# Altium project Fuel Cell Monitor Master.PrjPcb (part 2 of 2)

## Sheet LT1990(Input2).SchDoc
size E; SheetNumber: 5; SheetTotal: 6
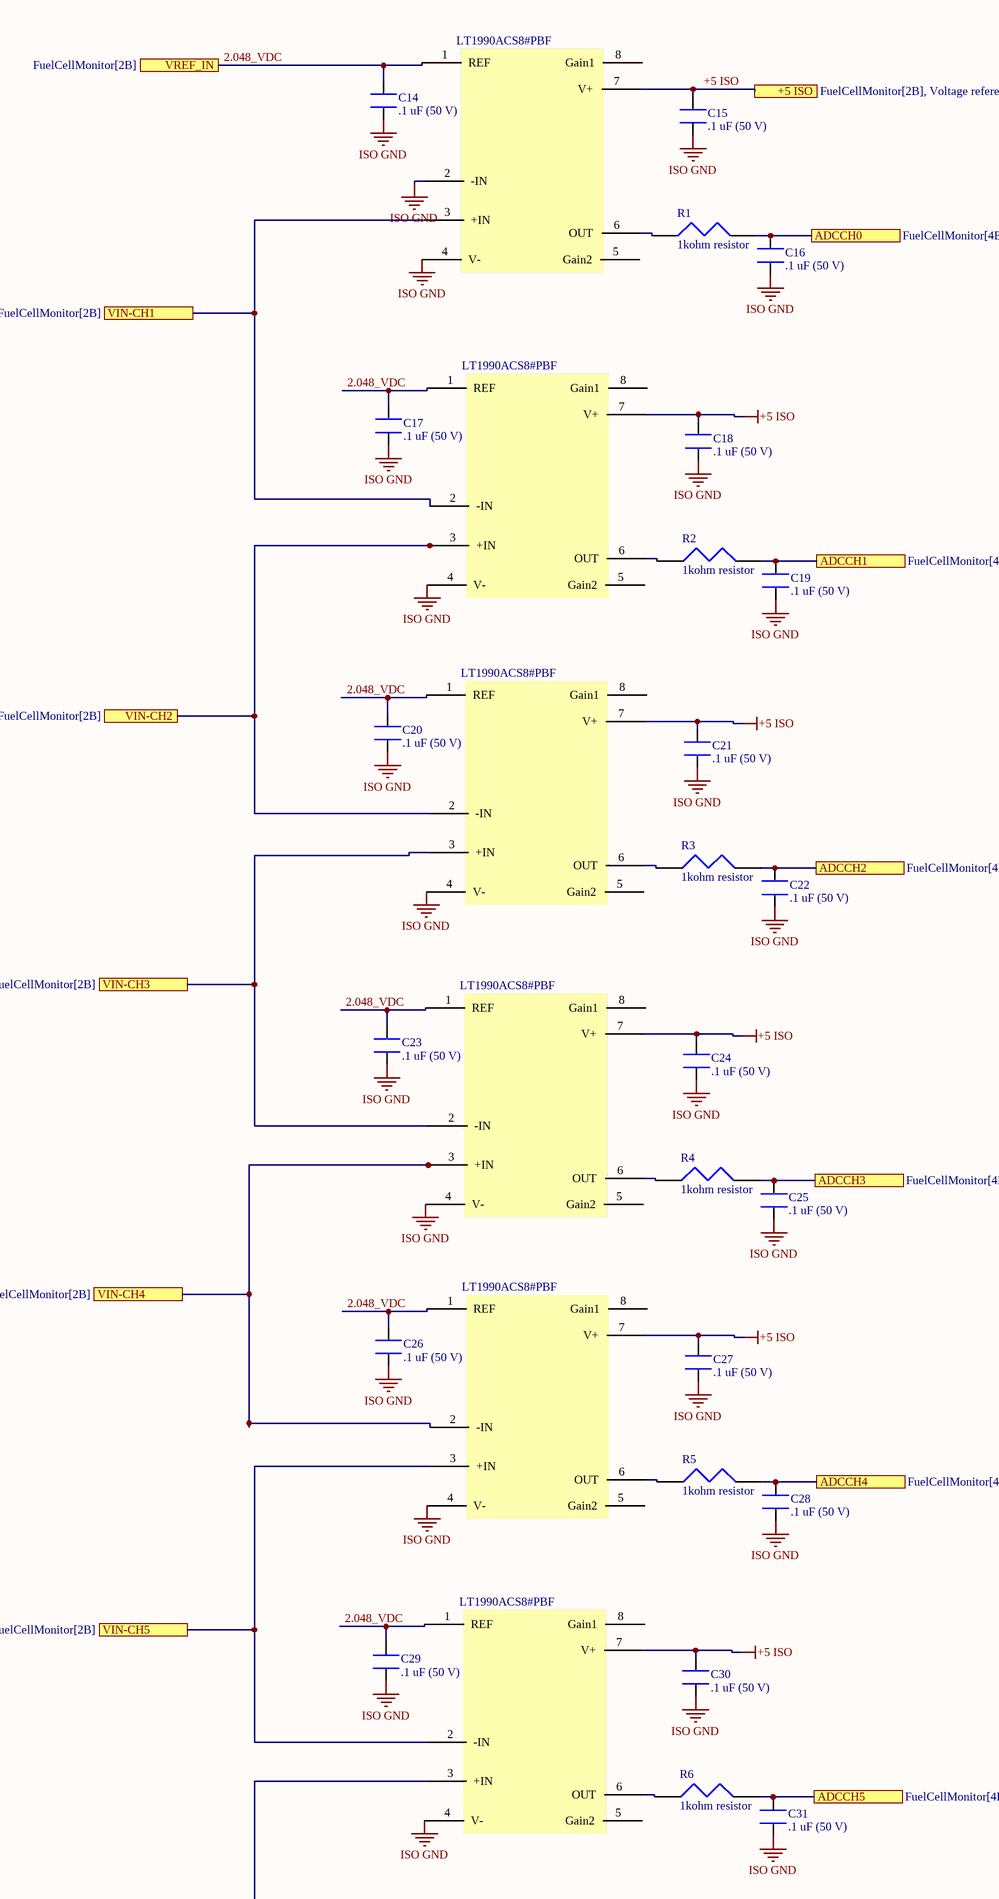
[diagram p6: LT1990(Input2).SchDoc, top left]
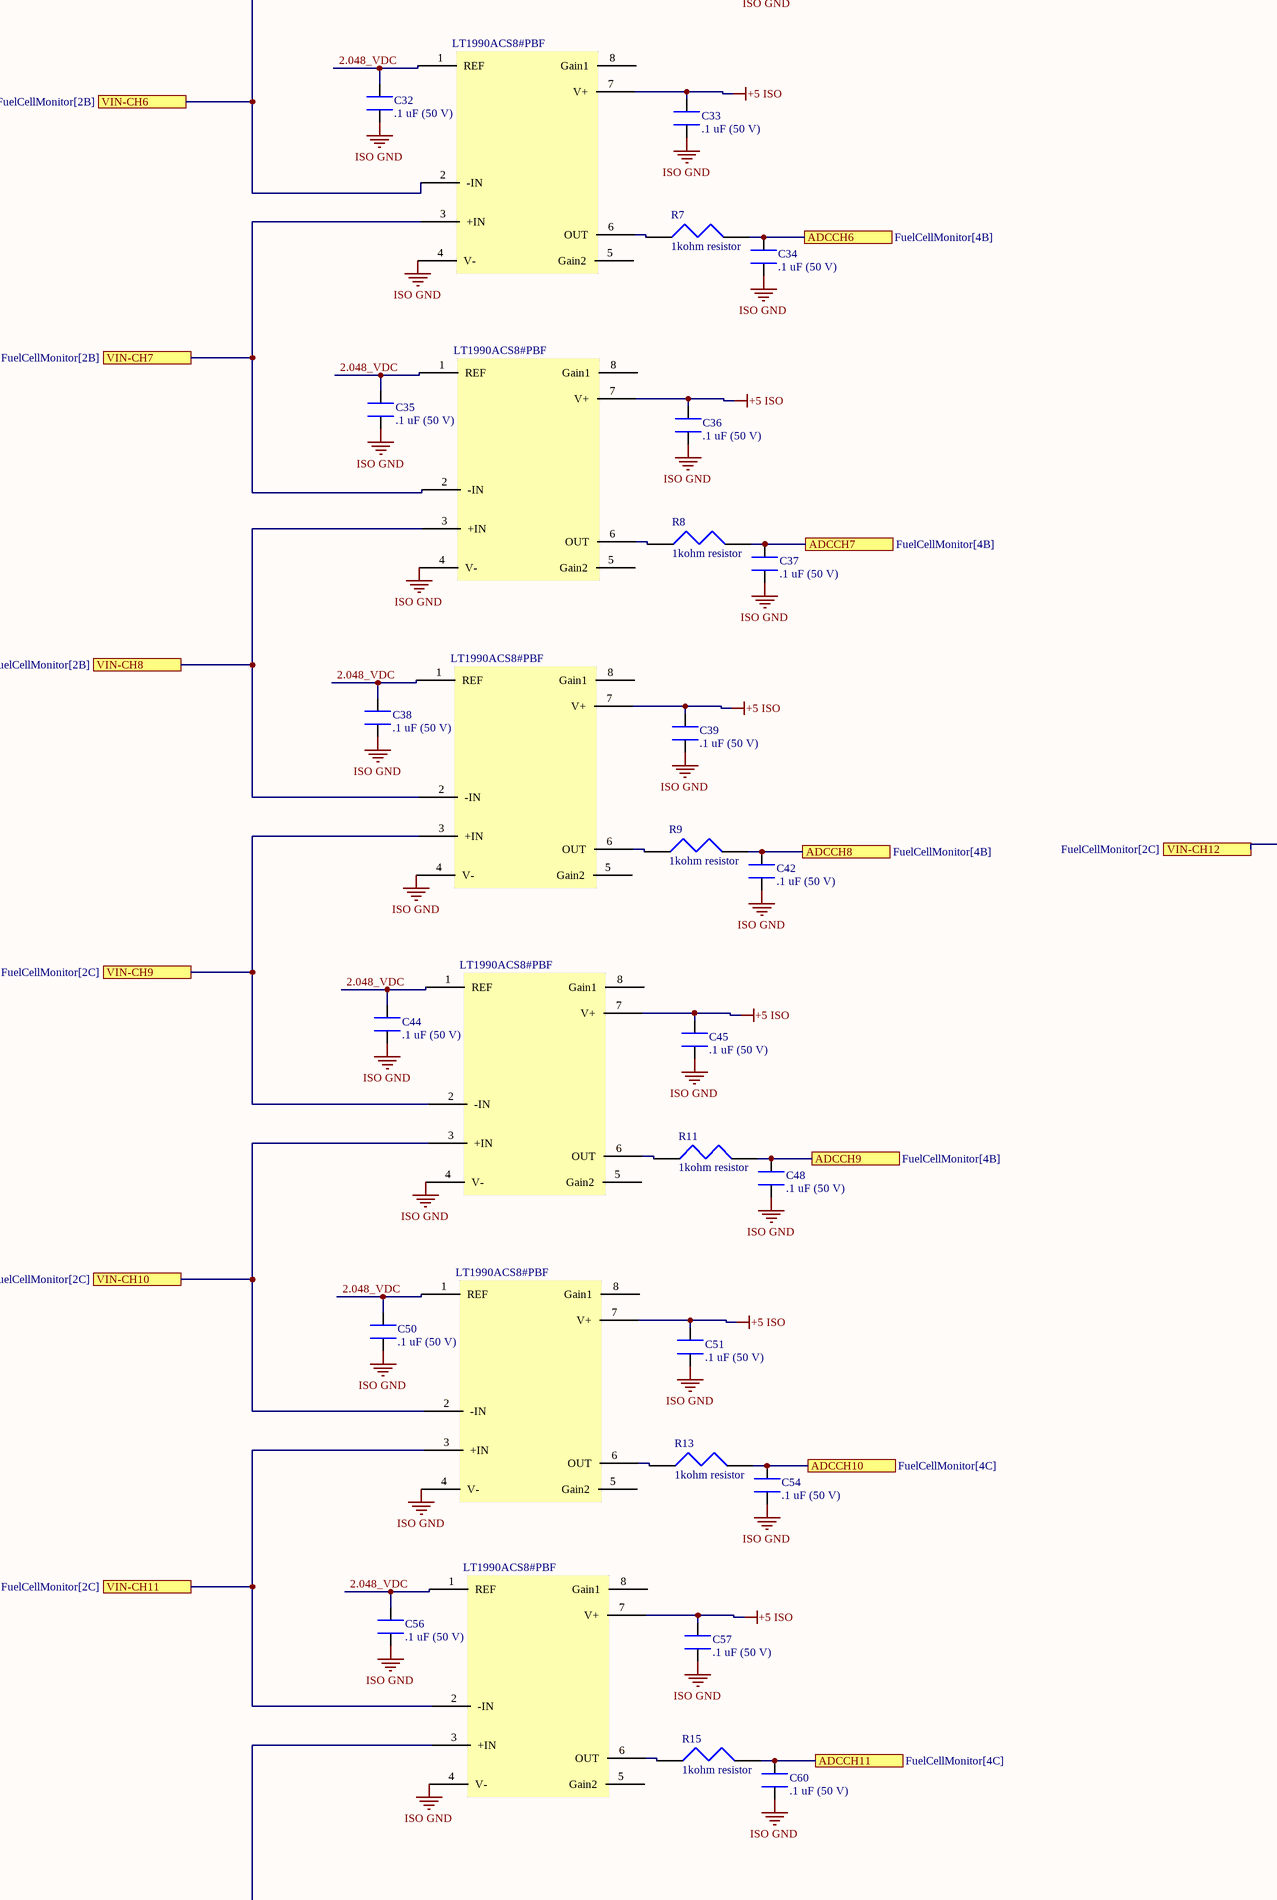
[diagram p7: LT1990(Input2).SchDoc, bottom left]
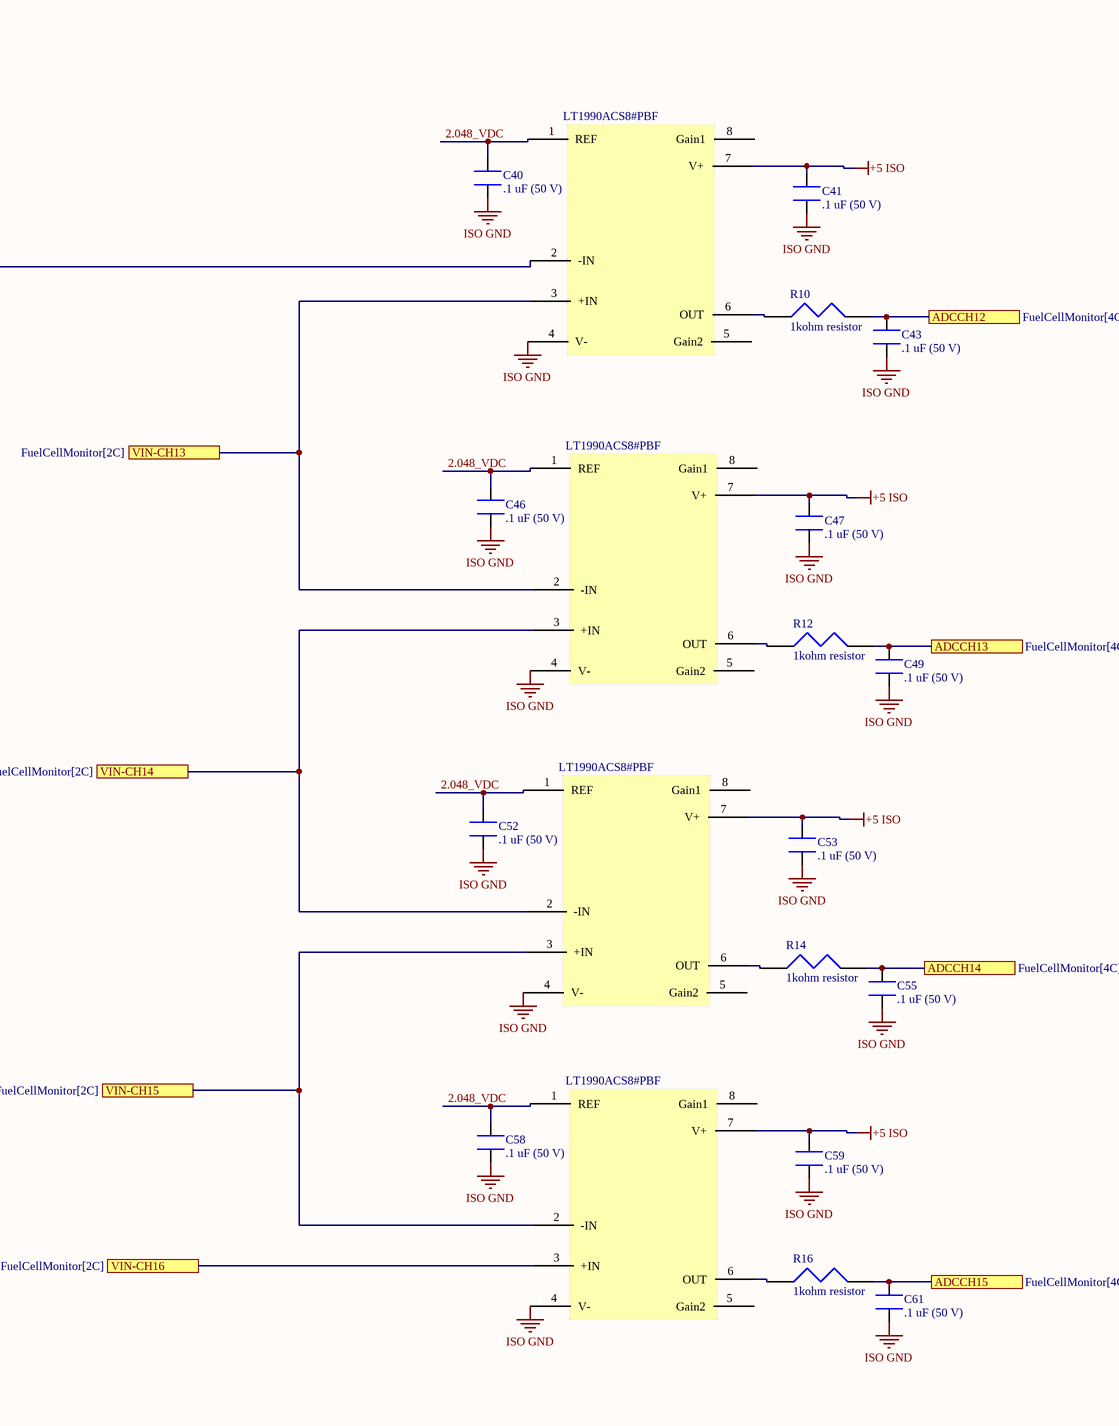
[diagram p8: LT1990(Input2).SchDoc, bottom right]

### Parts
(Parts that share a designator on the sheet are numbered #1, #2 ... from top to bottom, then left to right.)
C14#2  .1 uF (50 V)  [.1uF capacitor]
C15#2  .1 uF (50 V)  [.1uF capacitor]
C16#2  .1 uF (50 V)  [.1uF capacitor]
C17#2  .1 uF (50 V)  [.1uF capacitor]
C18#2  .1 uF (50 V)  [.1uF capacitor]
C19#2  .1 uF (50 V)  [.1uF capacitor]
C20#2  .1 uF (50 V)  [.1uF capacitor]
C21#2  .1 uF (50 V)  [.1uF capacitor]
C22  .1 uF (50 V)  [.1uF capacitor]
C23  .1 uF (50 V)  [.1uF capacitor]
C24  .1 uF (50 V)  [.1uF capacitor]
C25  .1 uF (50 V)  [.1uF capacitor]
C26  .1 uF (50 V)  [.1uF capacitor]
C27  .1 uF (50 V)  [.1uF capacitor]
C28  .1 uF (50 V)  [.1uF capacitor]
C29  .1 uF (50 V)  [.1uF capacitor]
C30  .1 uF (50 V)  [.1uF capacitor]
C31  .1 uF (50 V)  [.1uF capacitor]
C32  .1 uF (50 V)  [.1uF capacitor]
C33  .1 uF (50 V)  [.1uF capacitor]
C34  .1 uF (50 V)  [.1uF capacitor]
C35  .1 uF (50 V)  [.1uF capacitor]
C36  .1 uF (50 V)  [.1uF capacitor]
C37  .1 uF (50 V)  [.1uF capacitor]
C38  .1 uF (50 V)  [.1uF capacitor]
C39  .1 uF (50 V)  [.1uF capacitor]
C40  .1 uF (50 V)  [.1uF capacitor]
C41  .1 uF (50 V)  [.1uF capacitor]
C42  .1 uF (50 V)  [.1uF capacitor]
C43  .1 uF (50 V)  [.1uF capacitor]
C44  .1 uF (50 V)  [.1uF capacitor]
C45  .1 uF (50 V)  [.1uF capacitor]
C46  .1 uF (50 V)  [.1uF capacitor]
C47  .1 uF (50 V)  [.1uF capacitor]
C48  .1 uF (50 V)  [.1uF capacitor]
C49  .1 uF (50 V)  [.1uF capacitor]
C50  .1 uF (50 V)  [.1uF capacitor]
C51  .1 uF (50 V)  [.1uF capacitor]
C52  .1 uF (50 V)  [.1uF capacitor]
C53  .1 uF (50 V)  [.1uF capacitor]
C54  .1 uF (50 V)  [.1uF capacitor]
C55  .1 uF (50 V)  [.1uF capacitor]
C56  .1 uF (50 V)  [.1uF capacitor]
C57  .1 uF (50 V)  [.1uF capacitor]
C58  .1 uF (50 V)  [.1uF capacitor]
C59  .1 uF (50 V)  [.1uF capacitor]
C60  .1 uF (50 V)  [.1uF capacitor]
C61  .1 uF (50 V)  [.1uF capacitor]
LT1  LT1990  [LT1990ACS8]  (value not drawn)
LT2  LT1990  [LT1990ACS8]  (value not drawn)
LT3  LT1990  [LT1990ACS8]  (value not drawn)
LT4  LT1990  [LT1990ACS8]  (value not drawn)
LT5  LT1990  [LT1990ACS8]  (value not drawn)
LT6  LT1990  [LT1990ACS8]  (value not drawn)
LT7  LT1990  [LT1990ACS8]  (value not drawn)
LT8  LT1990  [LT1990ACS8]  (value not drawn)
LT9  LT1990  [LT1990ACS8]  (value not drawn)
LT10  LT1990  [LT1990ACS8]  (value not drawn)
LT11  LT1990  [LT1990ACS8]  (value not drawn)
LT12  LT1990  [LT1990ACS8]  (value not drawn)
LT13  LT1990  [LT1990ACS8]  (value not drawn)
LT14  LT1990  [LT1990ACS8]  (value not drawn)
LT15  LT1990  [LT1990ACS8]  (value not drawn)
LT16  LT1990  [LT1990ACS8]  (value not drawn)
R1#2  1kohm resistor  [1kohm resistor]
R2#2  1kohm resistor  [1kohm resistor]
R3#2  1kohm resistor  [1kohm resistor]
R4#2  1kohm resistor  [1kohm resistor]
R5#2  1kohm resistor  [1kohm resistor]
R6#2  1kohm resistor  [1kohm resistor]
R7#2  1kohm resistor  [1kohm resistor]
R8#2  1kohm resistor  [1kohm resistor]
R9#2  1kohm resistor  [1kohm resistor]
R10#2  1kohm resistor  [1kohm resistor]
R11#2  1kohm resistor  [1kohm resistor]
R12#2  1kohm resistor  [1kohm resistor]
R13#2  1kohm resistor  [1kohm resistor]
R14#2  1kohm resistor  [1kohm resistor]
R15#2  1kohm resistor  [1kohm resistor]
R16  1kohm resistor  [1kohm resistor]

### Ports
+5 ISO (see FuelCellMonitor[2B], Voltage reference[2B]), ADCCH0 (see FuelCellMonitor[4B]), ADCCH1 (see FuelCellMonitor[4B]), ADCCH2 (see FuelCellMonitor[4B]), ADCCH3 (see FuelCellMonitor[4B]), ADCCH4 (see FuelCellMonitor[4B]), ADCCH5 (see FuelCellMonitor[4B]), ADCCH6 (see FuelCellMonitor[4B]), ADCCH7 (see FuelCellMonitor[4B]), ADCCH8 (see FuelCellMonitor[4B]), ADCCH9 (see FuelCellMonitor[4B]), ADCCH10 (see FuelCellMonitor[4C]), ADCCH11 (see FuelCellMonitor[4C]), ADCCH12 (see FuelCellMonitor[4C]), ADCCH13 (see FuelCellMonitor[4C]), ADCCH14 (see FuelCellMonitor[4C]), ADCCH15 (see FuelCellMonitor[4C]), VIN-CH1 (see FuelCellMonitor[2B]), VIN-CH2 (see FuelCellMonitor[2B]), VIN-CH3 (see FuelCellMonitor[2B]), VIN-CH4 (see FuelCellMonitor[2B]), VIN-CH5 (see FuelCellMonitor[2B]), VIN-CH6 (see FuelCellMonitor[2B]), VIN-CH7 (see FuelCellMonitor[2B]), VIN-CH8 (see FuelCellMonitor[2B]), VIN-CH9 (see FuelCellMonitor[2C]), VIN-CH10 (see FuelCellMonitor[2C]), VIN-CH11 (see FuelCellMonitor[2C]), VIN-CH12 (see FuelCellMonitor[2C]), VIN-CH13 (see FuelCellMonitor[2C]), VIN-CH14 (see FuelCellMonitor[2C]), VIN-CH15 (see FuelCellMonitor[2C]), VIN-CH16 (see FuelCellMonitor[2C]), VREF_IN (see FuelCellMonitor[2B])

### Nets
+5 ISO: C15#2.2 C18#2.2 C21#2.2 C24.2 C27.2 C30.2 C33.2 C36.2 C39.2 C41.2 C45.2 C47.2 C51.2 C53.2 C57.2 C59.2 LT1.7(V+) LT2.7(V+) LT3.7(V+) LT4.7(V+) LT5.7(V+) LT6.7(V+) LT7.7(V+) LT8.7(V+) LT9.7(V+) LT10.7(V+) LT11.7(V+) LT12.7(V+) LT13.7(V+) LT14.7(V+) LT15.7(V+) LT16.7(V+) ; port +5 ISO
ISO GND: C14#2.1 C15#2.1 C16#2.1 C17#2.1 C18#2.1 C19#2.1 C20#2.1 C21#2.1 C22.1 C23.1 C24.1 C25.1 C26.1 C27.1 C28.1 C29.1 C30.1 C31.1 C32.1 C33.1 C34.1 C35.1 C36.1 C37.1 C38.1 C39.1 C40.1 C41.1 C42.1 C43.1 C44.1 C45.1 C46.1 C47.1 C48.1 C49.1 C50.1 C51.1 C52.1 C53.1 C54.1 C55.1 C56.1 C57.1 C58.1 C59.1 C60.1 C61.1 LT1.2(-IN) LT1.4(V-) LT2.4(V-) LT3.4(V-) LT4.4(V-) LT5.4(V-) LT6.4(V-) LT7.4(V-) LT8.4(V-) LT9.4(V-) LT10.4(V-) LT11.4(V-) LT12.4(V-) LT13.4(V-) LT14.4(V-) LT15.4(V-) LT16.4(V-)
2.048_VDC: C14#2.2 C17#2.2 C20#2.2 C23.2 C26.2 C29.2 C32.2 C35.2 C38.2 C40.2 C44.2 C46.2 C50.2 C52.2 C56.2 C58.2 LT1.1(REF) LT2.1(REF) LT3.1(REF) LT4.1(REF) LT5.1(REF) LT6.1(REF) LT7.1(REF) LT8.1(REF) LT9.1(REF) LT10.1(REF) LT11.1(REF) LT12.1(REF) LT13.1(REF) LT14.1(REF) LT15.1(REF) LT16.1(REF) ; port VREF_IN
Cell_1_Voltage: C16#2.2 R1#2.2 ; port ADCCH0
Cell_2_Voltage: C19#2.2 R2#2.2 ; port ADCCH1
Cell_3_Voltage: C22.2 R3#2.2 ; port ADCCH2
Cell_4_Voltage: C25.2 R4#2.2 ; port ADCCH3
Cell_5_Voltage: C28.2 R5#2.2 ; port ADCCH4
Cell_6_Voltage: C31.2 R6#2.2 ; port ADCCH5
Cell_7_Voltage: C34.2 R7#2.2 ; port ADCCH6
Cell_8_Voltage: C37.2 R8#2.2 ; port ADCCH7
Cell_9_Voltage: C42.2 R9#2.2 ; port ADCCH8
Cell_10_Voltage: C48.2 R11#2.2 ; port ADCCH9
Cell_11_Voltage: C54.2 R13#2.2 ; port ADCCH10
Cell_12_Voltage: C60.2 R15#2.2 ; port ADCCH11
Cell_13_Voltage: C43.2 R10#2.2 ; port ADCCH12
Cell_14_Voltage: C49.2 R12#2.2 ; port ADCCH13
Cell_15_Voltage: C55.2 R14#2.2 ; port ADCCH14
Cell_16_Voltage: C61.2 R16.2 ; port ADCCH15
Net1_1: LT1.3(+IN) LT2.2(-IN) ; port VIN-CH1
Net1_2: LT2.3(+IN) LT3.2(-IN) ; port VIN-CH2
Net1_3: LT3.3(+IN) LT4.2(-IN) ; port VIN-CH3
Net1_4: LT4.3(+IN) LT5.2(-IN) ; port VIN-CH4
Net1_5: LT5.3(+IN) LT6.2(-IN) ; port VIN-CH5
Net1_6: LT6.3(+IN) LT7.2(-IN) ; port VIN-CH6
Net1_7: LT7.3(+IN) LT8.2(-IN) ; port VIN-CH7
Net1_8: LT8.3(+IN) LT9.2(-IN) ; port VIN-CH8
Net1_9: LT9.3(+IN) LT10.2(-IN) ; port VIN-CH9
Net1_10: LT10.3(+IN) LT11.2(-IN) ; port VIN-CH10
Net1_11: LT11.3(+IN) LT12.2(-IN) ; port VIN-CH11
Net1_12: LT12.3(+IN) LT13.2(-IN) ; port VIN-CH12
Net1_13: LT13.3(+IN) LT14.2(-IN) ; port VIN-CH13
Net1_14: LT14.3(+IN) LT15.2(-IN) ; port VIN-CH14
Net1_15: LT15.3(+IN) LT16.2(-IN) ; port VIN-CH15
Net1_16: LT16.3(+IN) ; port VIN-CH16
NetLT1_6: LT1.6(OUT) R1#2.1
NetLT2_6: LT2.6(OUT) R2#2.1
NetLT3_6: LT3.6(OUT) R3#2.1
NetLT4_6: LT4.6(OUT) R4#2.1
NetLT5_6: LT5.6(OUT) R5#2.1
NetLT6_6: LT6.6(OUT) R6#2.1
NetLT7_6: LT7.6(OUT) R7#2.1
NetLT8_6: LT8.6(OUT) R8#2.1
NetLT9_6: LT9.6(OUT) R9#2.1
NetLT10_6: LT10.6(OUT) R11#2.1
NetLT11_6: LT11.6(OUT) R13#2.1
NetLT12_6: LT12.6(OUT) R15#2.1
NetLT13_6: LT13.6(OUT) R10#2.1
NetLT14_6: LT14.6(OUT) R12#2.1
NetLT15_6: LT15.6(OUT) R14#2.1
NetLT16_6: LT16.6(OUT) R16.1

Not connected (* = marked no-connect by the designer): LT1 5(Gain2) 8(Gain1); LT2 5(Gain2) 8(Gain1); LT3 5(Gain2) 8(Gain1); LT4 5(Gain2) 8(Gain1); LT5 5(Gain2) 8(Gain1); LT6 5(Gain2) 8(Gain1); LT7 5(Gain2) 8(Gain1); LT8 5(Gain2) 8(Gain1); LT9 5(Gain2) 8(Gain1); LT10 5(Gain2) 8(Gain1); LT11 5(Gain2) 8(Gain1); LT12 5(Gain2) 8(Gain1); LT13 5(Gain2) 8(Gain1); LT14 5(Gain2) 8(Gain1); LT15 5(Gain2) 8(Gain1); LT16 5(Gain2) 8(Gain1)

### Notes on the sheet
- (in symbol LT1990) LT1990ACS8#PBF

### Library data of the parts
C14#2 C15#2 C16#2 C17#2 C18#2 C19#2 C20#2 C21#2 C22-C61 = .1 uF cap

## Sheet Voltage reference.SchDoc
size A; SheetNumber: 6; SheetTotal: 6
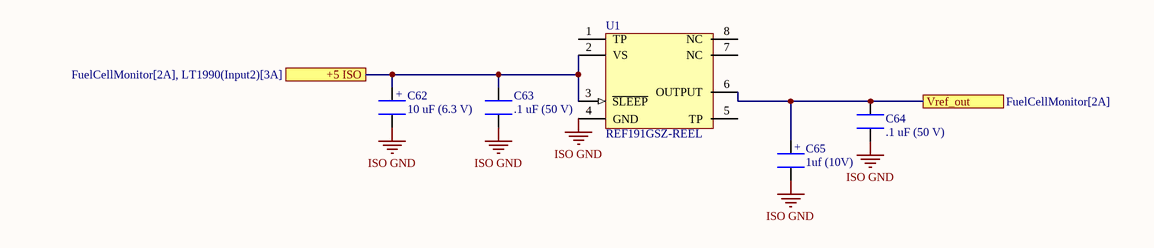
[diagram p9: Voltage reference.SchDoc]

### Parts
C62  10 uF (6.3 V)  [10 uF cap]
C63  .1 uF (50 V)  [.1uF capacitor]
C64  .1 uF (50 V)  [.1uF capacitor]
C65  1uf (10V)  [1 uF cap]
U1  REF191GSZ-REEL  [ADI-R-8_N]

### Ports
+5 ISO (see FuelCellMonitor[2A], LT1990(Input2)[3A]), Vref_out (see FuelCellMonitor[2A])

### Nets
ISO GND: C62.2 C63.2 C64.1 C65.2 U1.4(GND)
2.048_VDC: C64.2 C65.1 U1.6(OUTPUT) ; port Vref_out
NetC62_1: C62.1 C63.1 U1.2(VS) U1.3(~{SLEEP}) ; port +5 ISO

Not connected (* = marked no-connect by the designer): U1 1(TP) 5(TP) 7(NC) 8(NC)

### Notes on the sheet
- (in symbol 1uf cap) +
- (in symbol 10 uF cap) +

### Library data of the parts
C62 = 10 uF cap
C63 C64 = .1 uF cap
C65 = 1uf cap
U1 = REF191GSZ-REEL: Precision Micropower, Low Dropout Voltage Reference, 2.048 V Output, 2.3 to 15 V Supply, Industrial, 8-pin SOIC (R-8), Reel; Manufacturer: Analog Devices; Vout: 2.048V; Ref Out TC (ppm/C): 10; Mounting Technology: Surface Mount; ComponentLink3URL: http://www.analog.com/static/imported-files/packages/PKG_PDF/SOIC_Narrow%20(R)/R_8.pdf; PackageDescription: 8-Pin Standard Small Outline Package, Body 4.9 x 3.9 mm, Pitch 1.27 mm; PackageVersion: 060506-A, 06/2006; ComponentLink1Description: Manufacturer URL; Code_JEDEC: MS-012-AA; ComponentLink2URL: http://www.analog.com/static/imported-files/data_sheets/REF19xSeries.pdf; Operating Temp Range: -40 to 85 degC; PartNumber: REF191GSZ-REEL; Packing: Reel; ComponentLink3Description: Package Specification; ComponentLink4Description: URL Link1; PackageReference: R-8; ComponentLink1URL: http://www.analog.com/en/index.html; ComponentLink4URL: Product URL:http://www.analog.com/en/special-linear-functions/voltage-references/ref191/products/product.html; DatasheetVersion: Rev. L; ComponentLink2Description: Datasheet

## Sheet LM2595sx-3.3.SchDoc
size A; SheetNumber: 3; SheetTotal: 6
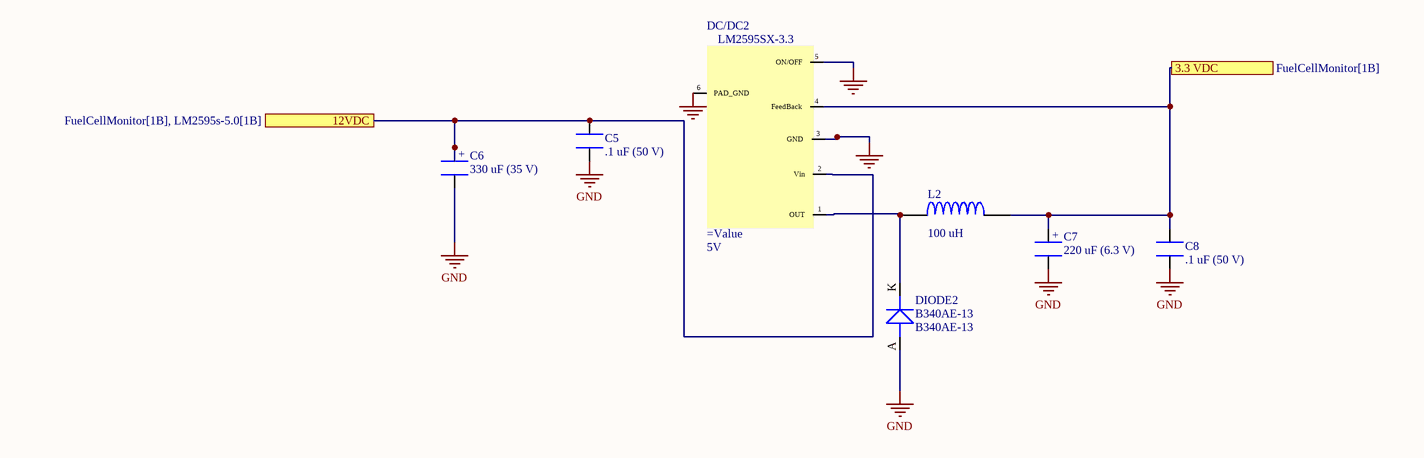
[diagram p10: LM2595sx-3.3.SchDoc]

### Parts
(Parts that share a designator on the sheet are numbered #1, #2 ... from top to bottom, then left to right.)
C5#2  .1 uF (50 V)  [.1uF capacitor]
C6#2  330 uF (35 V)  [330uf cap]
C7#2  220 uF (6.3 V)  [220 uf cap]
C8#2  .1 uF (50 V)  [.1uF capacitor]
DC/DC2  Output Voltage: 5V  [LM2595s-3.3]
DIODE2  B340AE-13  [B340AE-13]
L2  100 uH  [100uH inductor]

### Ports
3.3 VDC (see FuelCellMonitor[1B]), 12VDC (see FuelCellMonitor[1B], LM2595s-5.0[1B])

### Nets
+3V3: C7#2.1 C8#2.2 DC/DC2.4(FeedBack) L2.2 ; port 3.3 VDC
+12: C5#2.2 C6#2.1 DC/DC2.2(Vin) ; port 12VDC
GND: C5#2.1 C6#2.2 C7#2.2 C8#2.1 DC/DC2.3(GND) DC/DC2.5(ON/OFF) DC/DC2.6(PAD_GND) DIODE2.A
NetDC/DC2_1: DC/DC2.1(OUT) DIODE2.K L2.1

### Notes on the sheet
- (in symbol 220 uF capacitor) +
- (in symbol 330 uF cap) +
- (in symbol LM2595SX-3.3/NOPB_1) LM2595SX-3.3

### Library data of the parts
C5#2 C8#2 = .1 uF cap
C6#2 = 330 uF cap
C7#2 = 220 uF capacitor
DC/DC2 = LM2595SX-3.3/NOPB_1: SIMPLE SWITCHE Power Converter 150 KHz 1A Step-Down Voltage egulator 5-DDPAK/TO-263; Manufacturer: Texas Instruments; Manufacturer Part Number: LM2595S-5.0/NOPB; Number of Outputs: 1; Efficiency: 82%; Min Input Voltage: 4.5V; Max Input Voltage: 40V; Frequency: 150kHz; Switching Frequency: 173kHz; Quiescent Current: 5mA; Output Type: Fixed; Supplier 1: Digi-Key; RoHS: Yes; Category: Voltage Regulators - Switching; Mount: Surface Mount; Case/Package: TO-263; Number of Pins: 5; Weight: 0.25lb; Min Operating Temperature: -40°C; Max Operating Temperature: 125°C; Output Current: 1A; Package Quantity: 45; Packaging: Rail/Tube; Max Output Current: 1A; Max Supply Voltage: 40V; Min Supply Voltage: 4.5V; Nominal Output Voltage: 5V; Max Output Voltage: 5V; Termination: SMD/SMT; Length: 10.16mm; Width: 8.64mm; Height: 4.57mm; Radiation Hardening: No; Lead Free: Contains Lead; RoHS Compliant: Yes; REACH SVHC: No SVHC; ComponentLink1URL: https://datasheet.ciiva.com/14150/eanatsemico-schaltr-lm2595-en-14150687.pdf?src-supplier=Distrelec; ComponentLink1Description: https://datasheet.ciiva.com/14150/eanatsemico-schaltr-lm2595-en-14150687.pdf?src-supplier=Distrelec; ComponentLink2URL: https://datasheet.ciiva.com/15112/getdatasheetpartid-89913-15112836.pdf?src-supplier=Verical; ComponentLink2Description: https://datasheet.ciiva.com/15112/getdatasheetpartid-89913-15112836.pdf?src-supplier=Verical; ComponentLink3URL: https://datasheet.ciiva.com/25775/1771567-25775403.pdf?src-supplier=Farnell; ComponentLink3Description: https://datasheet.ciiva.com/25775/1771567-25775403.pdf?src-supplier=Farnell; ComponentLink4URL: https://datasheet.ciiva.com/22746/1771567-22746709.pdf?src-supplier=Element14; ComponentLink4Description: https://datasheet.ciiva.com/22746/1771567-22746709.pdf?src-supplier=Element14; ComponentLink5URL: https://datasheet.ciiva.com/3219/lm2595-3219977.pdf?src-supplier=Avnet; ComponentLink5Description: https://datasheet.ciiva.com/3219/lm2595-3219977.pdf?src-supplier=Avnet
DIODE2 = B340AE-13: Schottky Diode, DO-201, 40V, 3.00A; Manufacturer: STMicroelectronics; Max Surge Current: 80A; Average Rectified Current: 3A; Max Reverse Leakage Current: 2mA; Element Configuration: Single; Polarity: Standard; Forward Voltage: 950mV; Capacitance: 190pF; Supplier 1: Mouser; RoHS: Yes; Category: Rectifier Diodes; Stock 1: 125419; Pricing 1: 1=0.47000, 10=0.38600, 50=0.38600, 100=0.26300, 600=0.19700, 1000=0.19700, 1200=0.14700, 2400=0.12700, 9600=0.11900, 10000=0.11900 (USD); Mount: Through Hole; Case/Package: DO-201AD; Number of Pins: 2; Weight: 0.01lb; Min Operating Temperature: -65°C; Max Operating Temperature: 150°C; Package Quantity: 1; Packaging: Tape and Reel; Max Forward Surge Current (Ifsm): 80A; Voltage Rating (DC): 40V; Current Rating: 3A; Output Current: 3A; Max Reverse Voltage (DC): 40V; Series: -; Forward Current: 3A; Max Reverse Current: 2mA; Max Repetitive Reverse Voltage (Vrrm): 40V; Peak Non-Repetitive Surge Current: 80A; Length: 9.5mm; Width: 5.3mm; Height: 5.3mm; Radiation Hardening: No; Lead Free: Lead Free; RoHS Compliant: Yes; REACH SVHC: No SVHC; ComponentLink1URL: https://datasheet.ciiva.com/1177/1689683-1177129.pdf?src-supplier=Element14; ComponentLink1Description: https://datasheet.ciiva.com/1177/1689683-1177129.pdf?src-supplier=Element14; ComponentLink2URL: https://datasheet.ciiva.com/26339/168275-da-01-en-schottky-barrier-rectif-axial-1n5822-26339005.pdf?src-supplier=Conrad; ComponentLink2Description: https://datasheet.ciiva.com/26339/168275-da-01-en-schottky-barrier-rectif-axial-1n5822-26339005.pdf?src-supplier=Conrad; ComponentLink3URL: https://datasheet.ciiva.com/16303/cd00001626-16303311.pdf?src-supplier=Future+Electronics; ComponentLink3Description: https://datasheet.ciiva.com/16303/cd00001626-16303311.pdf?src-supplier=Future+Electronics; ComponentLink4URL: https://datasheet.ciiva.com/916/cd00001626-916051.pdf?src-supplier=Digi-Key; ComponentLink4Description: https://datasheet.ciiva.com/916/cd00001626-916051.pdf?src-supplier=Digi-Key; ComponentLink5URL: https://datasheet.ciiva.com/916/cd00001626-916050.pdf?src-supplier=Digi-Key; ComponentLink5Description: https://datasheet.ciiva.com/916/cd00001626-916050.pdf?src-supplier=Digi-Key; Supplier Part Number 1: 511-1N5822; Manufacturer Part Number: B340AE-13
L2 = 100 uH inductor

## Sheet DCP020505U.SchDoc
size A; SheetNumber: 4; SheetTotal: 6
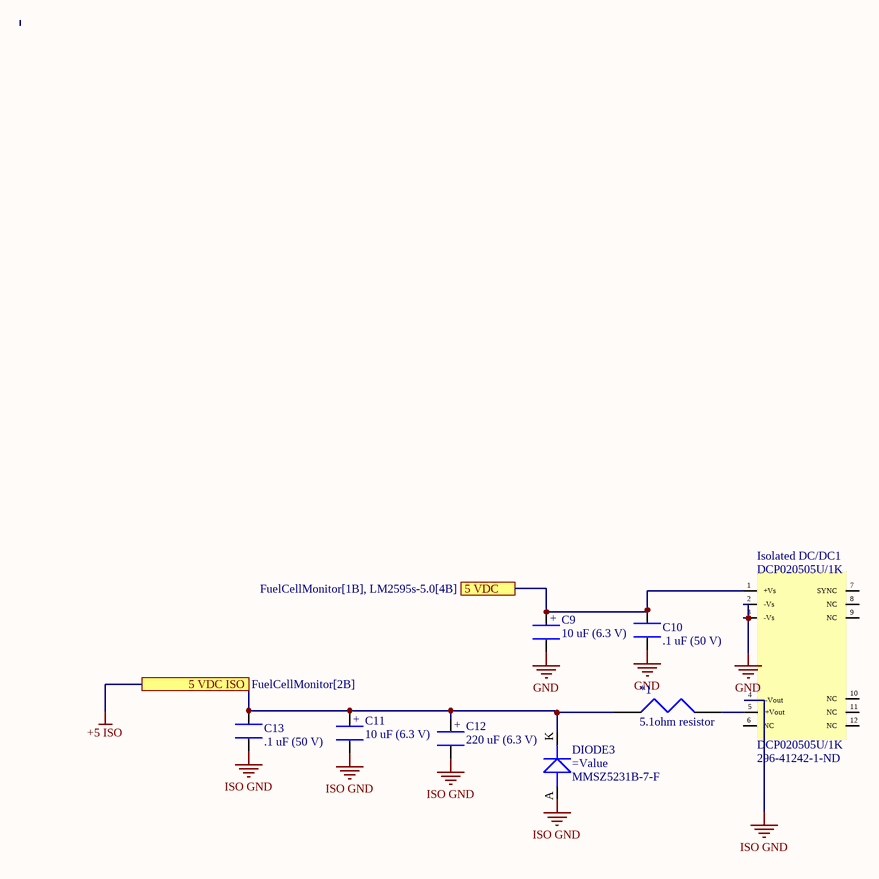
[diagram p11: DCP020505U.SchDoc]

### Parts
(Parts that share a designator on the sheet are numbered #1, #2 ... from top to bottom, then left to right.)
*1  5.1ohm resistor  [5.1 ohm resistor]
C9#2  10 uF (6.3 V)  [10 uF cap]
C10  .1 uF (50 V)  [.1uF capacitor]
C11  10 uF (6.3 V)  [10 uF cap]
C12  220 uF (6.3 V)  [220 uf cap]
C13  .1 uF (50 V)  [.1uF capacitor]
DIODE3  (no value)  [MMSZ5231B-7-F Zener diode]
Isolated_DC/DC1  DCP020505U/1K  Supplier Part Number 1: 296-41242-1-ND  [DCP020505U - duplicate]

### Ports
5 VDC (see FuelCellMonitor[1B], LM2595s-5.0[4B]), 5 VDC ISO (see FuelCellMonitor[2B])

### Nets
+5 ISO: *1.1 C11.1 C12.1 C13.2 DIODE3.K ; port 5 VDC ISO
GND: C9#2.2 C10.1 Isolated_DC/DC1.2(-Vs) Isolated_DC/DC1.3(-Vs)
ISO GND: C11.2 C12.2 C13.1 DIODE3.A Isolated_DC/DC1.4(-Vout)
Net*1_2: *1.2 Isolated_DC/DC1.5(+Vout)
NetC9#2_1: C9#2.1 C10.2 Isolated_DC/DC1.1(+Vs) ; port 5 VDC

Not connected (* = marked no-connect by the designer): Isolated_DC/DC1 6(NC) 7(SYNC) 8(NC) 9(NC) 10(NC) 11(NC) 12(NC)

### Notes on the sheet
- (in symbol 10 uF cap) +
- (in symbol 220 uF capacitor) +

### Library data of the parts
C9#2 C11 = 10 uF cap
C10 C13 = .1 uF cap
C12 = 220 uF capacitor
DIODE3 = MMSZ5231B-7-F: Zener diode; Manufacturer: STMicroelectronics; Max Surge Current: 80A; Average Rectified Current: 3A; Max Reverse Leakage Current: 2mA; Element Configuration: Single; Polarity: Standard; Voltage Rating (DC): 40V; Forward Voltage: 950mV; Capacitance: 190pF; Supplier 1: Mouser; RoHS: Yes; Category: Rectifier Diodes; Stock 1: 125419; Pricing 1: 1=0.47000, 10=0.38600, 50=0.38600, 100=0.26300, 600=0.19700, 1000=0.19700, 1200=0.14700, 2400=0.12700, 9600=0.11900, 10000=0.11900 (USD); Mount: Through Hole; Case/Package: DO-201AD; Number of Pins: 2; Weight: 0.01lb; Min Operating Temperature: -65°C; Max Operating Temperature: 150°C; Package Quantity: 1; Packaging: Tape and Reel; Max Forward Surge Current (Ifsm): 80A; Current Rating: 3A; Output Current: 3A; Max Reverse Voltage (DC): 40V; Series: -; Forward Current: 3A; Max Reverse Current: 2mA; Max Repetitive Reverse Voltage (Vrrm): 40V; Peak Non-Repetitive Surge Current: 80A; Length: 9.5mm; Width: 5.3mm; Height: 5.3mm; Radiation Hardening: No; Lead Free: Lead Free; RoHS Compliant: Yes; REACH SVHC: No SVHC; ComponentLink1URL: https://datasheet.ciiva.com/1177/1689683-1177129.pdf?src-supplier=Element14; ComponentLink1Description: https://datasheet.ciiva.com/1177/1689683-1177129.pdf?src-supplier=Element14; ComponentLink2URL: https://datasheet.ciiva.com/26339/168275-da-01-en-schottky-barrier-rectif-axial-1n5822-26339005.pdf?src-supplier=Conrad; ComponentLink2Description: https://datasheet.ciiva.com/26339/168275-da-01-en-schottky-barrier-rectif-axial-1n5822-26339005.pdf?src-supplier=Conrad; ComponentLink3URL: https://datasheet.ciiva.com/16303/cd00001626-16303311.pdf?src-supplier=Future+Electronics; ComponentLink3Description: https://datasheet.ciiva.com/16303/cd00001626-16303311.pdf?src-supplier=Future+Electronics; ComponentLink4URL: https://datasheet.ciiva.com/916/cd00001626-916051.pdf?src-supplier=Digi-Key; ComponentLink4Description: https://datasheet.ciiva.com/916/cd00001626-916051.pdf?src-supplier=Digi-Key; ComponentLink5URL: https://datasheet.ciiva.com/916/cd00001626-916050.pdf?src-supplier=Digi-Key; ComponentLink5Description: https://datasheet.ciiva.com/916/cd00001626-916050.pdf?src-supplier=Digi-Key; Supplier Part Number 1: 511-1N5822; Manufacturer Part Number: MMSZ5231B-7-F
Isolated_DC/DC1 = DCP020505U/1K: Miniature, 2W Isolated Unregulated DC/DC Converters 12-SOP -40 to 85; Manufacturer: Texas Instruments; Number of Outputs: 1; Efficiency: 80%; Max Output Current: 400mA; Max Input Voltage: 5.5V; Min Input Voltage: 4.5V; Voltage - Output 1: 5V; Isolation Voltage: 1kV; Max Power Dissipation: 90mW; Switching Frequency: 400kHz; Max Output Voltage: 5.25V; Min Output Voltage: 4.75V; Quiescent Current: 18mA; Output Type: Fixed; Supplier 1: Digi-Key; Manufacturer Part Number: DCP020505U/1K; RoHS: Yes; Category: Integrated Circuits (ICs); Case/Package: SOP; Number of Pins: 12; Min Operating Temperature: -40°C; Max Operating Temperature: 85°C; Packaging: Tape and Reel; Features: OTP; Package Quantity: 1000; Output Voltage: 5V; Output Current: 400mA; Output Power: 2W; Current - Output 1: 400mA; Max Output Power: 2W; Series: DCP02; Length: 0.71inch; Width: 0.3inch; Height: 0.1inch; Radiation Hardening: No; Lead Free: Lead Free; RoHS Compliant: Yes; ComponentLink1URL: https://datasheet.ciiva.com/2035/dcp020503-2035713.pdf?src-supplier=Digi-Key; ComponentLink1Description: https://datasheet.ciiva.com/2035/dcp020503-2035713.pdf?src-supplier=Digi-Key

## Sheet PIC32.SchDoc
size A; SheetNumber: 13; SheetTotal: 13
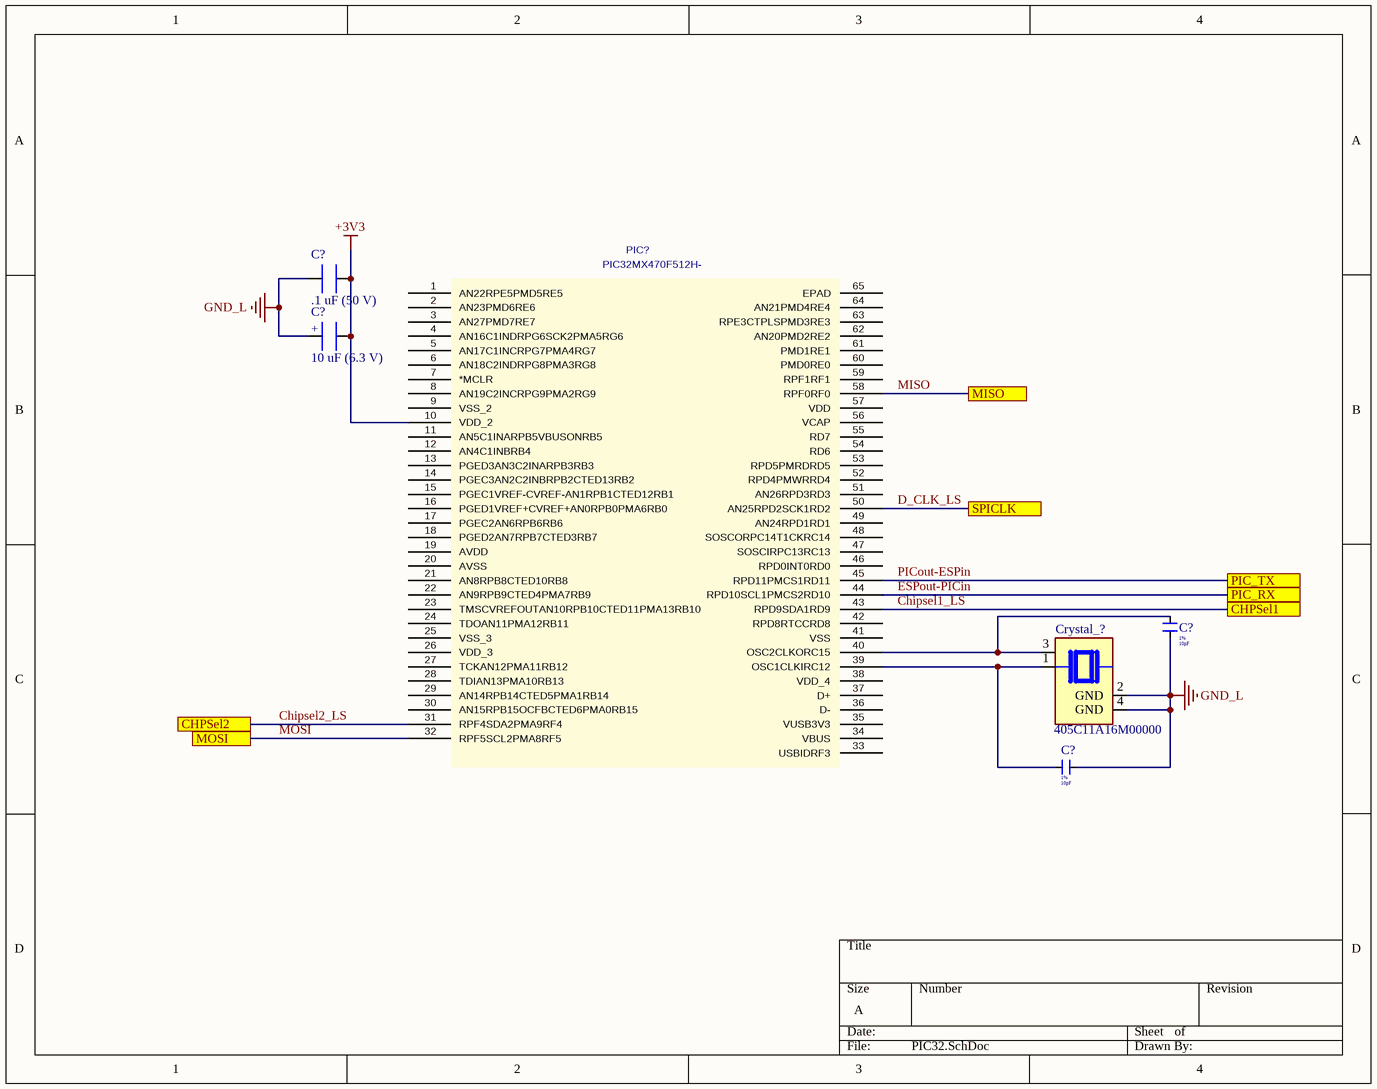
[diagram p12: PIC32.SchDoc]

### Parts
(Parts that share a designator on the sheet are numbered #1, #2 ... from top to bottom, then left to right.)
C?#1  .1 uF (50 V)  [.1uF capacitor]
C?#2  10 uF (6.3 V)  [10 uF cap]
C?#3  Tollerance: 1%  Capacitance: 10pF  [Kemet_10pF_0805]
C?#4  Tollerance: 1%  Capacitance: 10pF  [Kemet_10pF_0805]
Crystal_?  405C11A16M00000  [XTAL_405C11A16M00000]
PIC?  PIC32MX470F512H-  [Quad64]

### Ports
CHPSel1, CHPSel2, MISO, MOSI, PIC_RX, PIC_TX, SPICLK

### Nets
+3V3: C?#1.2 C?#2.2 PIC?.10(VDD_2)
GND_L: C?#1.1 C?#2.1 C?#3.2 C?#4.1 Crystal_?.2(GND) Crystal_?.4(GND)
Chipsel1_LS: PIC?.43(RPD9SDA1RD9) ; port CHPSel1
Chipsel2_LS: PIC?.31(RPF4SDA2PMA9RF4) ; port CHPSel2
D_CLK_LS: PIC?.50(AN25RPD2SCK1RD2) ; port SPICLK
ESPout-PICin: PIC?.44(RPD10SCL1PMCS2RD10) ; port PIC_RX
MISO: PIC?.58(RPF0RF0) ; port MISO  [project net D_out_1L]
MOSI: PIC?.32(RPF5SCL2PMA8RF5) ; port MOSI  [project net D_in_LS]
PICout-ESPin: PIC?.45(RPD11PMCS1RD11) ; port PIC_TX
NetC?#3_1: C?#3.1 Crystal_?.3 PIC?.40(OSC2CLKORC15)
NetC?#4_2: C?#4.2 Crystal_?.1 PIC?.39(OSC1CLKIRC12)

Not connected (* = marked no-connect by the designer): PIC? 1(AN22RPE5PMD5RE5) 2(AN23PMD6RE6) 3(AN27PMD7RE7) 4(AN16C1INDRPG6SCK2PMA5RG6) 5(AN17C1INCRPG7PMA4RG7) 6(AN18C2INDRPG8PMA3RG8) 7(*MCLR) 8(AN19C2INCRPG9PMA2RG9) 9(VSS_2) 11(AN5C1INARPB5VBUSONRB5) 12(AN4C1INBRB4) 13(PGED3AN3C2INARPB3RB3) 14(PGEC3AN2C2INBRPB2CTED13RB2) 15(PGEC1VREF-CVREF-AN1RPB1CTED12RB1) 16(PGED1VREF+CVREF+AN0RPB0PMA6RB0) 17(PGEC2AN6RPB6RB6) 18(PGED2AN7RPB7CTED3RB7) 19(AVDD) 20(AVSS) 21(AN8RPB8CTED10RB8) 22(AN9RPB9CTED4PMA7RB9) 23(TMSCVREFOUTAN10RPB10CTED11PMA13RB10) 24(TDOAN11PMA12RB11) 25(VSS_3) 26(VDD_3) 27(TCKAN12PMA11RB12) 28(TDIAN13PMA10RB13) 29(AN14RPB14CTED5PMA1RB14) 30(AN15RPB15OCFBCTED6PMA0RB15) 33(USBIDRF3) 34(VBUS) 35(VUSB3V3) 36(D-) 37(D+) 38(VDD_4) 41(VSS) 42(RPD8RTCCRD8) 46(RPD0INT0RD0) 47(SOSCIRPC13RC13) 48(SOSCORPC14T1CKRC14) 49(AN24RPD1RD1) 51(AN26RPD3RD3) 52(RPD4PMWRRD4) 53(RPD5PMRDRD5) 54(RD6) 55(RD7) 56(VCAP) 57(VDD) 59(RPF1RF1) 60(PMD0RE0) 61(PMD1RE1) 62(AN20PMD2RE2) 63(RPE3CTPLSPMD3RE3) 64(AN21PMD4RE4) 65(EPAD)

### Notes on the sheet
- (in symbol 10 uF cap) +

### Library data of the parts
C?#1 = .1 uF cap
C?#2 = 10 uF cap
C?#3 C?#4 = C0805C100F5GACAUTO: Cap, AEC-Q200, 10PF, 50V, Mlcc, 0805;; Manufacturer: KEMET; Supplier 1: Digi-Key; RoHS: Yes; Category: Ceramic Capacitors; Stock 1: 3879; Pricing 1: 1=0.74000, 10=0.54800, 50=0.43840, 100=0.37570, 500=0.29744, 1000=0.25048 (USD); RoHS Compliant: Yes; Supplier Part Number 1: 399-C0805C100F5GACAUTOCT-ND; Manufacturer Part Number: C0805C100F5GACAUTO
Crystal_? = 405C11A16M00000: CRYSTAL 16.0000MHZ 10PF SMD; MF: CTS-Frequency Controls; Digi-Key_Part_Number: CTX834TR-ND; Check_prices: https://www.snapeda.com/parts/405C11A16M00000/CTS-Frequency+Controls/view-part/?ref=eda; Purchase-URL: https://pricing.snapeda.com/search/part/405C11A16M00000/?ref=eda; Package: NON STANDARD-4 CTS Components; MP: 405C11A16M00000; Value: *; SnapEDA_Link: https://www.snapeda.com/parts/405C11A16M00000/CTS-Frequency+Controls/view-part/?ref=snap
PIC? = PIC32MX470F512H-: Mfr_Name: Microchip; Manufacturer_Part_Number: PIC32MX470F512H-I/MR; C: Copyright (C) 2018 Accelerated Designs. All rights reserved; Value: PIC32MX470F512H-; Copyright: Copyright (C) 2023 Ultra Librarian. All rights reserved.

## Nets that join several sheets
+3V3: OptoIso_L2H (OPIS1.1 OPIS1.3 OPIS1.5 OPIS1.7), OptoIso_H2L (6 pins), LM2595sx-3.3 (C7#2.1 C8#2.2 DC/DC2.4 L2.2), PIC32 (C?#1.2 C?#2.2 PIC?.10)
+5 ISO: ADC1 (7 pins), OptoIso_L2H (9 pins), OptoIso_H2L (OPIS2.1 OPIS2.7), ADC2 (7 pins), VRef_2 (5 pins), LT1990(Input2) (32 pins), DCP020505U (5 pins)
+12: Fuel Cell Schematic (J1.1), LM2595sx-3.3 (C5#2.2 C6#2.1 DC/DC2.2)
GND: ADC1 (7 pins), OptoIso_L2H (5 pins), ADC2 (7 pins), VRef_2 (6 pins), LM2595sx-3.3 (8 pins), DCP020505U (C9#2.2 C10.1 Isolated_DC/DC1.2 Isolated_DC/DC1.3)
GND_L: Fuel Cell Schematic (J1.2), OptoIso_H2L (C8#1.1 C9#1.1 OPIS2.9 OPIS2.16), PIC32 (6 pins)
ISO GND: LT1990(Input2) (65 pins), Voltage reference (5 pins), DCP020505U (5 pins)
2.048_VDC: LT1990(Input2) (32 pins), Voltage reference (C64.2 C65.1 U1.6)
Cell_1_Voltage: ADC1 (ADC1.1), LT1990(Input2) (C16#2.2 R1#2.2)
Cell_2_Voltage: ADC1 (ADC1.2), LT1990(Input2) (C19#2.2 R2#2.2)
Cell_3_Voltage: ADC1 (ADC1.3), LT1990(Input2) (C22.2 R3#2.2)
Cell_4_Voltage: ADC1 (ADC1.4), LT1990(Input2) (C25.2 R4#2.2)
Cell_5_Voltage: ADC1 (ADC1.5), LT1990(Input2) (C28.2 R5#2.2)
Cell_6_Voltage: ADC1 (ADC1.6), LT1990(Input2) (C31.2 R6#2.2)
Cell_7_Voltage: ADC1 (ADC1.7), LT1990(Input2) (C34.2 R7#2.2)
Cell_8_Voltage: ADC1 (ADC1.8), LT1990(Input2) (C37.2 R8#2.2)
Cell_9_Voltage: ADC2 (ADC2.1), LT1990(Input2) (C42.2 R9#2.2)
Cell_10_Voltage: ADC2 (ADC2.2), LT1990(Input2) (C48.2 R11#2.2)
Cell_11_Voltage: ADC2 (ADC2.3), LT1990(Input2) (C54.2 R13#2.2)
Cell_12_Voltage: ADC2 (ADC2.4), LT1990(Input2) (C60.2 R15#2.2)
Cell_13_Voltage: ADC2 (ADC2.5), LT1990(Input2) (C43.2 R10#2.2)
Cell_14_Voltage: ADC2 (ADC2.6), LT1990(Input2) (C49.2 R12#2.2)
Cell_15_Voltage: ADC2 (ADC2.7), LT1990(Input2) (C55.2 R14#2.2)
Cell_16_Voltage: ADC2 (ADC2.8), LT1990(Input2) (C61.2 R16.2)
Chipsel1_HS: ADC1 (ADC1.18), OptoIso_L2H (OPIS1.12 R6#1.2)
Chipsel1_LS: OptoIso_L2H (R2#1.2), PIC32 (PIC?.43)
Chipsel2_HS: OptoIso_L2H (OPIS1.14 R8#1.2), ADC2 (ADC2.18)
Chipsel2_LS: OptoIso_L2H (R4#1.2), PIC32 (PIC?.31)
D_CLK_LS: OptoIso_L2H (R1#1.2), PIC32 (PIC?.50)
D_In_HS: ADC1 (ADC1.17), OptoIso_L2H (OPIS1.13 R7#1.2), ADC2 (ADC2.17)
D_in_LS: OptoIso_L2H (R3#1.2), PIC32 (PIC?.32)
D_out_1L: OptoIso_H2L (OPIS2.14 R9#1.1), PIC32 (PIC?.58)
D_out_HS: ADC1 (ADC1.15), OptoIso_H2L (R11#1.1), ADC2 (ADC2.15)
DCLK_HS: ADC1 (ADC1.19), OptoIso_L2H (OPIS1.11 R5#1.2), ADC2 (ADC2.19)
Net1_1: Fuel Cell Schematic (1.1), LT1990(Input2) (LT1.3 LT2.2)
Net1_2: Fuel Cell Schematic (1.2), LT1990(Input2) (LT2.3 LT3.2)
Net1_3: Fuel Cell Schematic (1.3), LT1990(Input2) (LT3.3 LT4.2)
Net1_4: Fuel Cell Schematic (1.4), LT1990(Input2) (LT4.3 LT5.2)
Net1_5: Fuel Cell Schematic (1.5), LT1990(Input2) (LT5.3 LT6.2)
Net1_6: Fuel Cell Schematic (1.6), LT1990(Input2) (LT6.3 LT7.2)
Net1_7: Fuel Cell Schematic (1.7), LT1990(Input2) (LT7.3 LT8.2)
Net1_8: Fuel Cell Schematic (1.8), LT1990(Input2) (LT8.3 LT9.2)
Net1_9: Fuel Cell Schematic (1.9), LT1990(Input2) (LT9.3 LT10.2)
Net1_10: Fuel Cell Schematic (1.10), LT1990(Input2) (LT10.3 LT11.2)
Net1_11: Fuel Cell Schematic (1.11), LT1990(Input2) (LT11.3 LT12.2)
Net1_12: Fuel Cell Schematic (1.12), LT1990(Input2) (LT12.3 LT13.2)
Net1_13: Fuel Cell Schematic (1.13), LT1990(Input2) (LT13.3 LT14.2)
Net1_14: Fuel Cell Schematic (1.14), LT1990(Input2) (LT14.3 LT15.2)
Net1_15: Fuel Cell Schematic (1.15), LT1990(Input2) (LT15.3 LT16.2)
Net1_16: Fuel Cell Schematic (1.16), LT1990(Input2) (LT16.3)
V_Ref: ADC1 (ADC1.11), ADC2 (ADC2.11), VRef_2 (C15#1.2 R14#1.2 Vref_2.5)